# EAGLE design io_board (EAGLE 7.7.0)
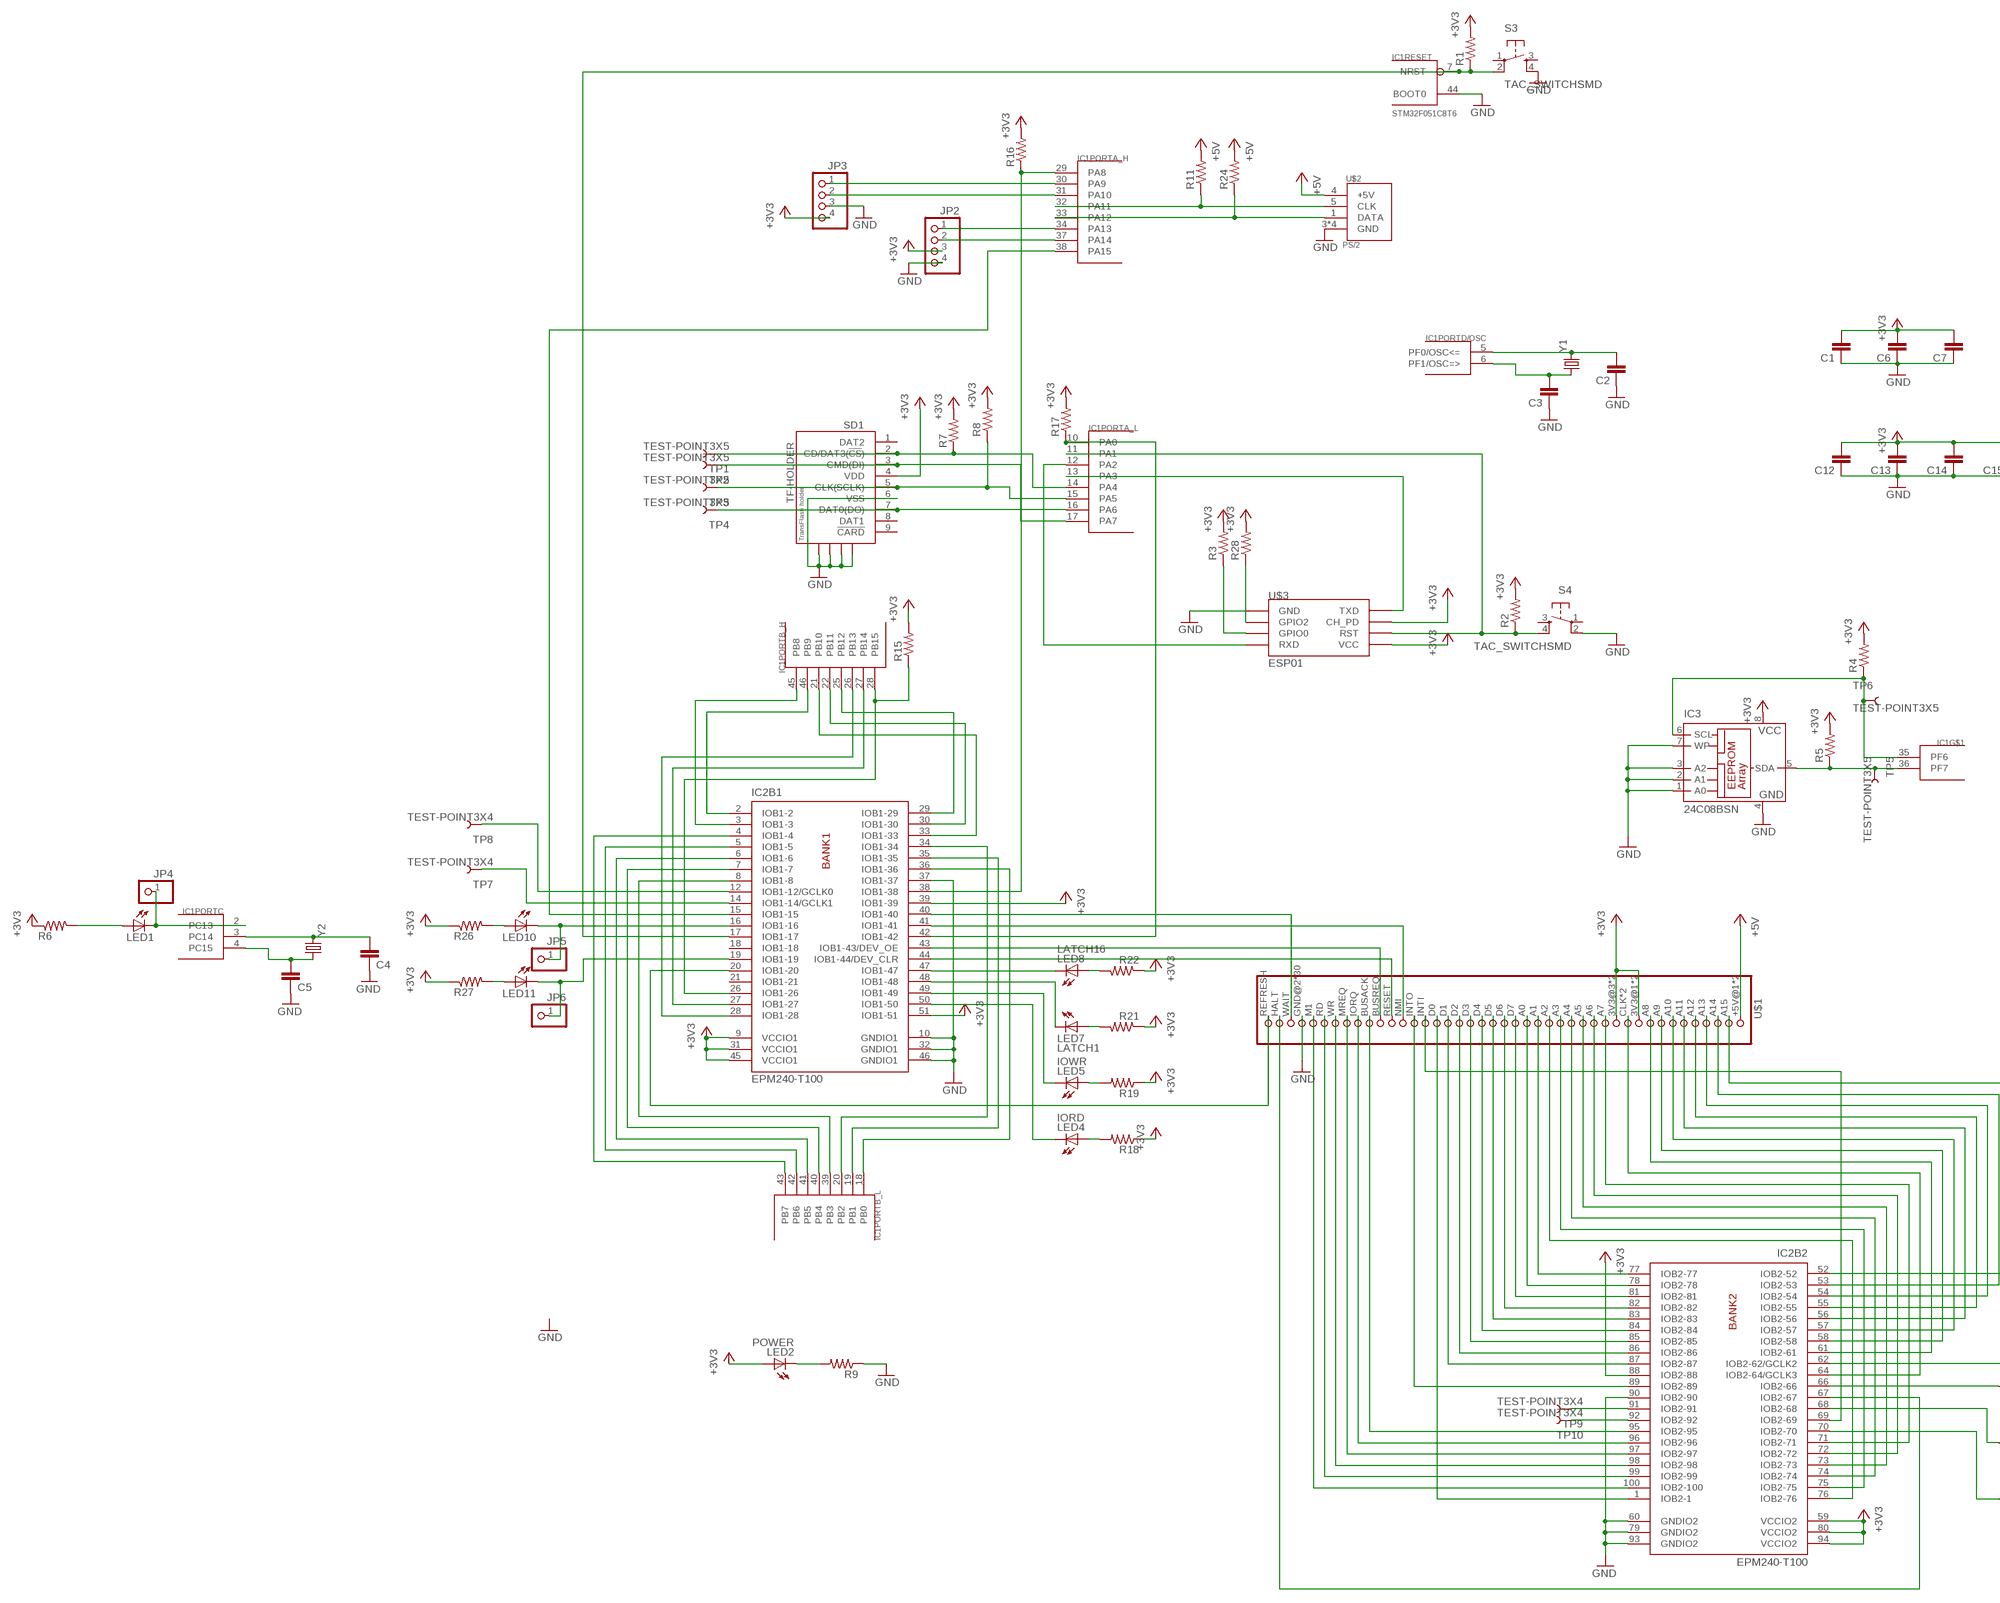
[diagram p0: schematic, sheet 1, part 1 of 2]
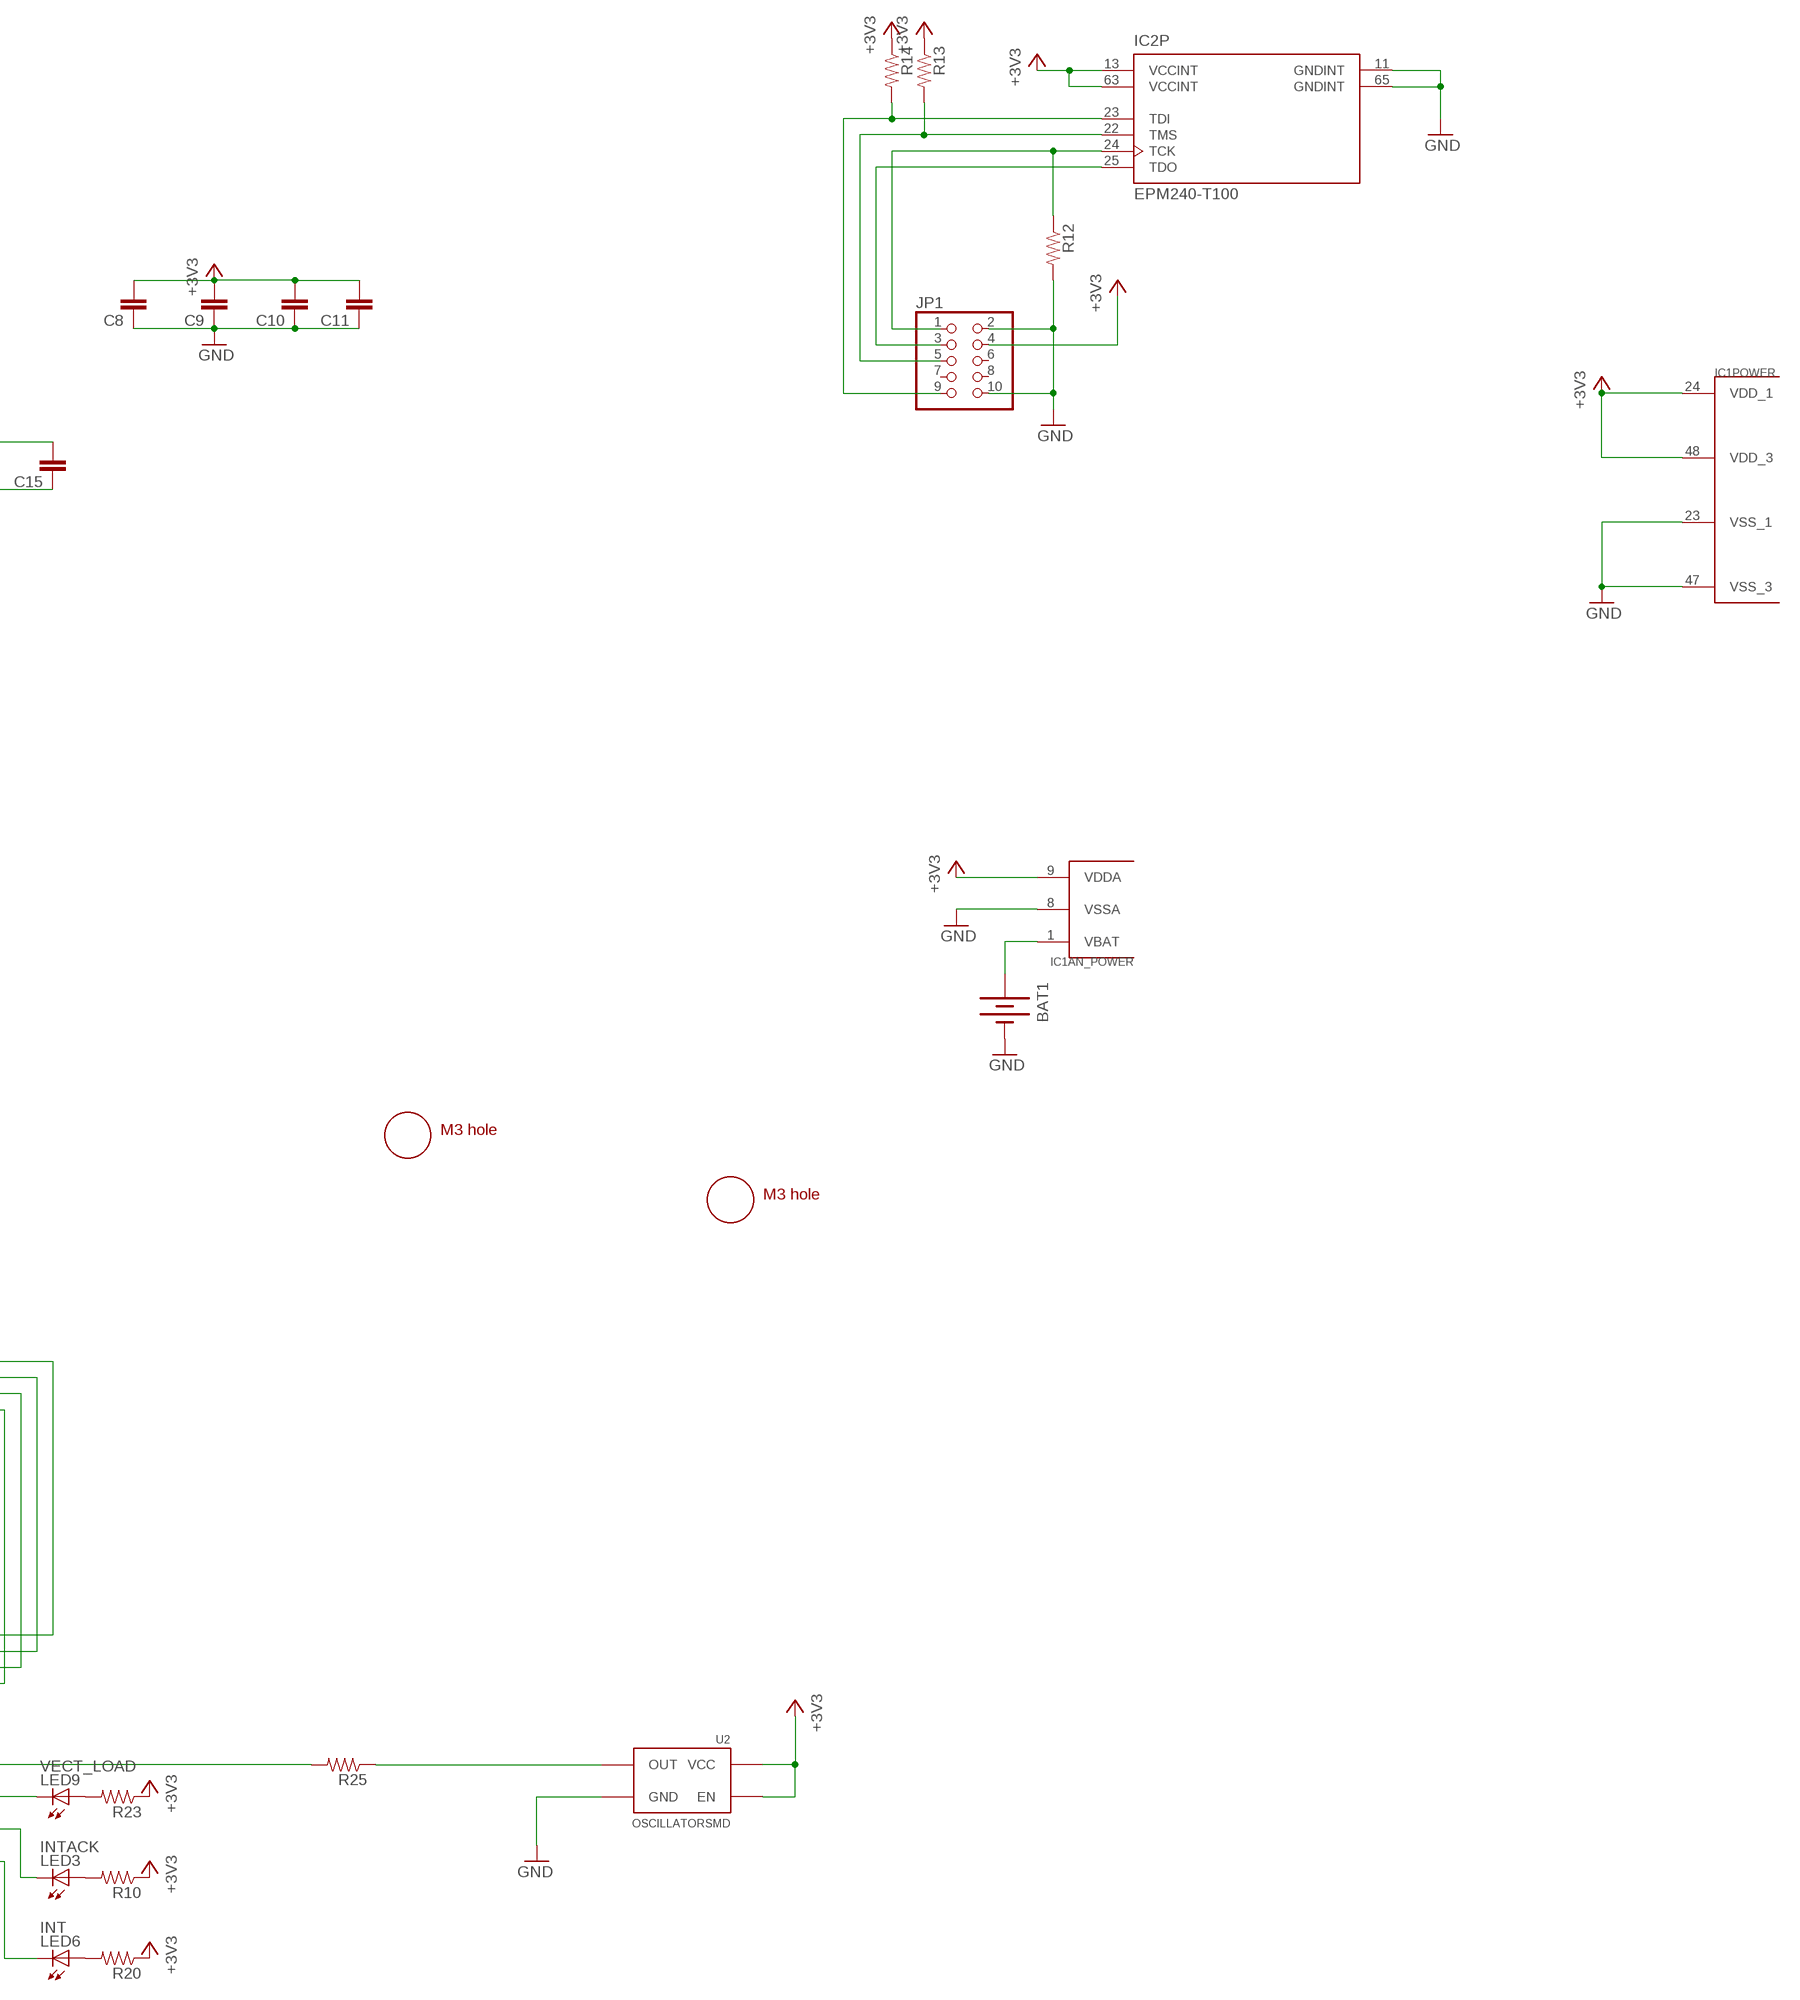
[diagram p1: schematic, sheet 1, part 2 of 2]

## Parts
BAT1  BATTERY20PTH  [BATTCOM_20MM_PTH]
C1  CAP0805  [0805]
C2  CAP0805  [0805]
C3  CAP0805  [0805]
C4  CAP0805  [0805]
C5  CAP0805  [0805]
C6  CAP0805  [0805]
C7  CAP0805  [0805]
C8  CAP0805  [0805]
C9  CAP0805  [0805]
C10  CAP0805  [0805]
C11  CAP0805  [0805]
C12  CAP0805  [0805]
C13  CAP0805  [0805]
C14  CAP0805  [0805]
C15  CAP0805  [0805]
IC1  STM32F051C8T6  [TQFP48]
IC2  EPM240-T100  [TQFP100]
IC3  24C08BSN  [SO-08]
JP1  PINHD-2X5  [2X05]
JP2  PINHD-1X4/90  [1X04/90]
JP3  PINHD-1X4/90  [1X04/90]
JP4  PINHD-1X1  [1X01]
JP5  PINHD-1X1  [1X01]
JP6  PINHD-1X1  [1X01]
LED1  LEDCHIP-LED0805  [CHIP-LED0805]
LED2  POWER  LEDCHIPLED_0805  [CHIPLED_0805]
LED3  INTACK  LEDCHIP-LED0805  [CHIP-LED0805]
LED4  IORD  LEDCHIP-LED0805  [CHIP-LED0805]
LED5  IOWR  LEDCHIP-LED0805  [CHIP-LED0805]
LED6  INT  LEDCHIP-LED0805  [CHIP-LED0805]
LED7  LATCH1  LEDCHIP-LED0805  [CHIP-LED0805]
LED8  LATCH16  LEDCHIP-LED0805  [CHIP-LED0805]
LED9  VECT_LOAD  LEDCHIP-LED0805  [CHIP-LED0805]
LED10  LEDCHIP-LED0805  [CHIP-LED0805]
LED11  LEDCHIP-LED0805  [CHIP-LED0805]
R1  RESISTOR0805-RES  [0805]
R2  RESISTOR0805-RES  [0805]
R3  RESISTOR0805-RES  [0805]
R4  RESISTOR0805-RES  [0805]
R5  RESISTOR0805-RES  [0805]
R6  RESISTOR0805-RES  [0805]
R7  RESISTOR0805-RES  [0805]
R8  RESISTOR0805-RES  [0805]
R9  RESISTOR0805-RES  [0805]
R10  RESISTOR0805-RES  [0805]
R11  RESISTOR0805-RES  [0805]
R12  RESISTOR0805-RES  [0805]
R13  RESISTOR0805-RES  [0805]
R14  RESISTOR0805-RES  [0805]
R15  RESISTOR0805-RES  [0805]
R16  RESISTOR0805-RES  [0805]
R17  RESISTOR0805-RES  [0805]
R18  RESISTOR0805-RES  [0805]
R19  RESISTOR0805-RES  [0805]
R20  RESISTOR0805-RES  [0805]
R21  RESISTOR0805-RES  [0805]
R22  RESISTOR0805-RES  [0805]
R23  RESISTOR0805-RES  [0805]
R24  RESISTOR0805-RES  [0805]
R25  RESISTOR0805-RES  [0805]
R26  RESISTOR0805-RES  [0805]
R27  RESISTOR0805-RES  [0805]
R28  RESISTOR0805-RES  [0805]
S3  TAC_SWITCHSMD  [TACTILE-SWITCH-SMD]
S4  TAC_SWITCHSMD  [TACTILE-SWITCH-SMD]
SD1  TF-HOLDER  [TF-PULL]
TP1  TEST-POINT3X5  [PAD.03X.05]
TP2  TEST-POINT3X5  [PAD.03X.05]
TP3  TEST-POINT3X5  [PAD.03X.05]
TP4  TEST-POINT3X5  [PAD.03X.05]
TP5  TEST-POINT3X5  [PAD.03X.05]
TP6  TEST-POINT3X5  [PAD.03X.05]
TP7  TEST-POINT3X4  [PAD.03X.04]
TP8  TEST-POINT3X4  [PAD.03X.04]
TP9  TEST-POINT3X4  [PAD.03X.04]
TP10  TEST-POINT3X4  [PAD.03X.04]
U2  OSCILLATORSMD  [CRYSTAL-SMD-7X5]
U$1  FAP_BUS  [2X38]
U$2  PS/2  [PS/2]
U$3  ESP01  [ESP01]
U$4  M3_MOUNTING_HOLE  [M3_MOUNTING_HOLE_PACK]
U$5  M3_MOUNTING_HOLE  [M3_MOUNTING_HOLE_PACK]
Y1  CRYSTALHC49US  [HC49US]
Y2  CRYSTALTC26H_EZ  [TC26HEZ]

## Nets
+3V3: C1.2 C6.2 C7.2 C8.2 C9.2 C10.2 C11.2 C12.2 C13.2 C14.2 C15.2 IC1.9(AN_POWER:VDDA) IC1.24(POWER:VDD_1) IC1.48(POWER:VDD_3) IC2.9(B1:VCCIO1) IC2.13(P:VCCINT) IC2.31(B1:VCCIO1) IC2.39(B1:IOB1-39) IC2.45(B1:VCCIO1) IC2.51(B1:IOB1-51) IC2.59(B2:VCCIO2) IC2.63(P:VCCINT) IC2.80(B2:VCCIO2) IC2.88(B2:IOB2-88) IC2.94(B2:VCCIO2) IC3.8(VCC) JP1.4 JP2.3 JP3.4 LED2.A R1.2 R2.2 R3.2 R4.2 R5.2 R6.1 R7.2 R8.2 R10.1 R13.1 R14.1 R15.2 R16.2 R17.2 R18.1 R19.1 R20.1 R21.1 R22.1 R23.1 R26.1 R27.1 R28.2 SD1.4(VDD) U2.P$1(EN) U2.P$4(VCC) U$1.3V3@1 U$1.3V3@2 U$1.3V3@3 U$1.3V3@4 U$3.CH_PD U$3.VCC
+5V: R11.2 R24.2 U$1.+5V@1 U$1.+5V@2 U$2.4(+5V)
GND: BAT1.2(-) C1.1 C2.1 C3.1 C4.1 C5.1 C6.1 C7.1 C8.1 C9.1 C10.1 C11.1 C12.1 C13.1 C14.1 C15.1 IC1.8(AN_POWER:VSSA) IC1.23(POWER:VSS_1) IC1.44(RESET:BOOT0) IC1.47(POWER:VSS_3) IC2.10(B1:GNDIO1) IC2.11(P:GNDINT) IC2.32(B1:GNDIO1) IC2.37(B1:IOB1-37) IC2.46(B1:GNDIO1) IC2.60(B2:GNDIO2) IC2.65(P:GNDINT) IC2.79(B2:GNDIO2) IC2.90(B2:IOB2-90) IC2.93(B2:GNDIO2) IC3.1(A0) IC3.2(A1) IC3.3(A2) IC3.4(GND) IC3.7(WP) JP1.2 JP1.10 JP2.4 JP3.3 R9.1 R12.2 S3.4 S4.2 SD1.6(VSS) SD1.S1 SD1.S2 SD1.S3 SD1.S4 U2.P$2(GND) U$1.GND@2(GND) U$1.GND@3(GND) U$1.GND@4(GND) U$1.GND@5(GND) U$1.GND@6(GND) U$1.GND@7(GND) U$1.GND@8(GND) U$1.GND@9(GND) U$1.GND@13(GND) U$1.GND@14(GND) U$1.GND@15(GND) U$1.GND@16(GND) U$1.GND@17(GND) U$1.GND@18(GND) U$1.GND@19(GND) U$1.GND@20(GND) U$1.GND@21(GND) U$1.GND@22(GND) U$1.GND@23(GND) U$1.GND@24(GND) U$1.GND@25(GND) U$1.GND@26(GND) U$1.GND@27(GND) U$1.GND@28(GND) U$1.GND@30(GND) U$1.GND@34(GND) U$1.GND@35(GND) U$1.GND@36(GND) U$1.GND@37(GND) U$1.GND@38(GND) U$2.3(GND) U$2.P$1(GND) U$2.P$2(GND) U$2.P$3(GND) U$3.GND
N$1: IC2.67(B2:IOB2-67) U$1.HALT
N$2: R25.1 U2.P$3(OUT)
N$3: IC2.20(B1:IOB1-20) U$1.REFRESH
N$4: IC2.12(B1:IOB1-12/GCLK0) TP8.P$1
N$5: IC1.7(RESET:NRST) IC2.17(B1:IOB1-17) R1.1 S3.2
N$6: C2.2 IC1.5(PORTD/OSC:PF0/OSC<=) Y1.2
N$7: C3.2 IC1.6(PORTD/OSC:PF1/OSC=>) Y1.1
N$8: C4.2 IC1.3(PORTC:PC14) Y2.2
N$9: C5.2 IC1.4(PORTC:PC15) Y2.1
N$10: BAT1.1(+) IC1.1(AN_POWER:VBAT)
N$11: IC1.37(PORTA_H:PA14) JP2.2
N$12: IC1.34(PORTA_H:PA13) JP2.1
N$13: IC2.62(B2:IOB2-62/GCLK2) R25.2
N$14: IC2.43(B1:IOB1-43/DEV_OE) U$1.BUSREQ
N$15: IC2.100(B2:IOB2-100) U$1.M1
N$16: IC2.99(B2:IOB2-99) U$1.RD
N$17: IC2.98(B2:IOB2-98) U$1.WR
N$18: IC2.97(B2:IOB2-97) U$1.MREQ
N$19: IC2.96(B2:IOB2-96) U$1.IORQ
N$20: IC2.95(B2:IOB2-95) U$1.BUSACK
N$21: IC2.44(B1:IOB1-44/DEV_CLR) U$1.RESET
N$22: LED3.A R10.2
N$23: IC2.89(B2:IOB2-89) U$1.INTO
N$24: IC2.1(B2:IOB2-1) U$1.D0
N$25: IC2.87(B2:IOB2-87) U$1.D1
N$26: IC2.86(B2:IOB2-86) U$1.D2
N$27: IC2.85(B2:IOB2-85) U$1.D3
N$28: IC2.84(B2:IOB2-84) U$1.D4
N$29: IC2.83(B2:IOB2-83) U$1.D5
N$30: IC2.82(B2:IOB2-82) U$1.D6
N$31: IC2.81(B2:IOB2-81) U$1.D7
N$32: IC2.78(B2:IOB2-78) U$1.A0
N$33: IC2.77(B2:IOB2-77) U$1.A1
N$34: IC2.76(B2:IOB2-76) U$1.A2
N$35: IC2.75(B2:IOB2-75) U$1.A3
N$36: IC2.74(B2:IOB2-74) U$1.A4
N$37: IC2.73(B2:IOB2-73) U$1.A5
N$38: IC2.72(B2:IOB2-72) U$1.A6
N$39: IC2.71(B2:IOB2-71) U$1.A7
N$40: IC2.64(B2:IOB2-64/GCLK3) U$1.CLK U$1.CLK@2
N$41: IC2.61(B2:IOB2-61) U$1.A8
N$42: IC2.58(B2:IOB2-58) U$1.A9
N$43: IC2.57(B2:IOB2-57) U$1.A10
N$44: IC2.56(B2:IOB2-56) U$1.A11
N$45: IC2.55(B2:IOB2-55) U$1.A12
N$46: IC2.54(B2:IOB2-54) U$1.A13
N$47: IC2.53(B2:IOB2-53) U$1.A14
N$48: IC2.52(B2:IOB2-52) U$1.A15
N$49: IC1.46(PORTB_H:PB9) IC2.2(B1:IOB1-2)
N$50: IC1.45(PORTB_H:PB8) IC2.3(B1:IOB1-3)
N$51: IC1.43(PORTB_L:PB7) IC2.4(B1:IOB1-4)
N$52: IC1.42(PORTB_L:PB6) IC2.5(B1:IOB1-5)
N$53: IC1.41(PORTB_L:PB5) IC2.6(B1:IOB1-6)
N$54: IC1.40(PORTB_L:PB4) IC2.7(B1:IOB1-7)
N$55: IC1.39(PORTB_L:PB3) IC2.8(B1:IOB1-8)
N$56: IC1.28(PORTB_H:PB15) IC2.26(B1:IOB1-26) R15.1
N$57: IC1.27(PORTB_H:PB14) IC2.27(B1:IOB1-27)
N$58: IC1.26(PORTB_H:PB13) IC2.28(B1:IOB1-28)
N$59: IC1.25(PORTB_H:PB12) IC2.29(B1:IOB1-29)
N$60: IC1.22(PORTB_H:PB11) IC2.30(B1:IOB1-30)
N$61: IC1.21(PORTB_H:PB10) IC2.33(B1:IOB1-33)
N$62: IC1.20(PORTB_L:PB2) IC2.34(B1:IOB1-34)
N$63: IC1.19(PORTB_L:PB1) IC2.35(B1:IOB1-35)
N$64: IC1.18(PORTB_L:PB0) IC2.36(B1:IOB1-36)
N$65: IC1.32(PORTA_H:PA11) R11.1 U$2.5(CLK)
N$66: IC1.33(PORTA_H:PA12) R24.1 U$2.1(DATA)
N$67: IC1.11(PORTA_L:PA1) R2.1 S4.4 U$3.RST
N$68: R3.1 U$3.GPIO0
N$69: IC1.36(PF7) IC3.5(SDA) R5.1 TP5.P$1
N$70: IC1.35(PF6) IC3.6(SCL) R4.1 TP6.P$1
N$71: IC1.31(PORTA_H:PA10) JP3.2
N$72: IC1.30(PORTA_H:PA9) JP3.1
N$73: IC1.2(PORTC:PC13) JP4.1 LED1.C
N$74: LED1.A R6.2
N$75: IC1.12(PORTA_L:PA2) U$3.RX(RXD)
N$76: IC1.13(PORTA_L:PA3) U$3.TX(TXD)
N$77: LED4.A R18.2
N$78: IC1.14(PORTA_L:PA4) R7.1 SD1.2(CD/DAT3(!CS!)) TP1.P$1
N$79: IC1.17(PORTA_L:PA7) SD1.3(CMD(DI)) TP2.P$1
N$80: IC1.16(PORTA_L:PA6) SD1.7(DAT0(DO)) TP4.P$1
N$81: IC1.15(PORTA_L:PA5) R8.1 SD1.5(CLK(SCLK)) TP3.P$1
N$82: LED2.C R9.2
N$83: LED7.A R21.2
N$84: LED5.A R19.2
N$85: IC1.38(PORTA_H:PA15) IC2.15(B1:IOB1-15)
N$86: IC1.10(PORTA_L:PA0) IC2.42(B1:IOB1-42) R17.1
N$87: IC1.29(PORTA_H:PA8) IC2.38(B1:IOB1-38) R16.1
N$88: LED6.A R20.2
N$89: LED8.A R22.2
N$90: IC2.47(B1:IOB1-47) LED8.C
N$91: IC2.48(B1:IOB1-48) LED7.C
N$92: IC2.49(B1:IOB1-49) LED5.C
N$93: IC2.50(B1:IOB1-50) LED4.C
N$94: LED9.A R23.2
N$95: IC2.66(B2:IOB2-66) LED9.C
N$96: IC2.68(B2:IOB2-68) LED3.C
N$97: IC2.70(B2:IOB2-70) LED6.C
N$98: IC2.14(B1:IOB1-14/GCLK1) TP7.P$1
N$99: IC2.69(B2:IOB2-69) U$1.INTI
N$100: IC2.41(B1:IOB1-41) U$1.NMI
N$101: IC2.40(B1:IOB1-40) U$1.WAIT
N$102: LED10.A R26.2
N$103: IC2.16(B1:IOB1-16) JP5.1 LED10.C
N$104: LED11.A R27.2
N$105: IC2.19(B1:IOB1-19) JP6.1 LED11.C
N$106: IC2.91(B2:IOB2-91) TP9.P$1
N$107: IC2.92(B2:IOB2-92) TP10.P$1
N$108: R28.1 U$3.GPIO2
TCK: IC2.24(P:TCK) JP1.1 R12.1
TDI: IC2.23(P:TDI) JP1.9 R14.2
TDO: IC2.25(P:TDO) JP1.3
TMS: IC2.22(P:TMS) JP1.5 R13.2
Unconnected: IC2.18(B1:IOB1-18) IC2.21(B1:IOB1-21) JP1.6 JP1.7 JP1.8 S3.1 S3.3 S4.1 S4.3 SD1.1(DAT2) SD1.8(DAT1) SD1.9(!CARD)

## Library data of the parts
BAT1 = SparkFun-Electromechanical:BATTERY: Battery Holders Various common sizes : AA, AAA, 18650 (PRT-12895), 20mm coin cell and 12mm coin cell. 20MM_4LEGS, BATT-10373
C1-C15 = SparkFun-Passives:CAP: Capacitor Standard 0603 ceramic capacitor, and 0.1" leaded capacitor.
IC1 = stm32f051:STM32F051C8T6: ST STM32F101/103 48pin LQFP
IC2 = altera-max2:EPM240-T100: Altera MAX II CPLD - EPM240 TQFP-100 Device EPM240 from Altera MAX II Family Feature EPM240 LEs 240 Typical Equivalent Macrocells 192 Equivalent Macrocell Range 128 ... 240 UFM Size (bits) 8192 User I/O pins 80 tPD1 (ns) 4.7 fCNT (MHz) 304 tSU (ns) 1.7 tCO (ns) 4.3
IC3 = microchip:24*: Serial EEPROM I2C; MPN: AT24C08BN-SH-B; OC_FARNELL: 1362645; OC_NEWARK: 50M3318
JP1 = pinhead:PINHD-2X5: PIN HEADER
JP2 JP3 = pinhead:PINHD-1X4: PIN HEADER
JP4-JP6 = pinhead:PINHD-1X1: PIN HEADER
LED1-LED11 = adafruit:LED: LED OSRAM: - CHIPLED LG R971, LG N971, LY N971, LG Q971, LY Q971, LO R971, LY R971 LH N974, LH R974 LS Q976, LO Q976, LY Q976 LO Q996 - Hyper CHIPLED LW Q18S LB Q993, LB Q99A, LB R99A - SideLED LS A670, LO A670, LY A670, LG A670, LP A670 LB A673, LV A673, LT A673, LW A673 LH A674 LY A675 LS A676, LA A676, LO A676, LY A676, LW A676 LS A679, LY A679, LG A679 - Hyper Micro SIDELED® LS Y876, LA Y876, LO Y876, LY Y876 LT Y87S - SmartLED LW L88C, LW L88S LB L89C, LB L89S, LG L890 LS L89K, LO L89K, LY L89K LS L896, LA L896, LO L896, LY L896 - TOPLED LS T670, LO T670, LY T670, LG T670, LP T670 LSG T670, LSP T670, LSY T670, LOP T670, LYG T670 LG T671, LOG T671, LSG T671 LB T673, LV T673, LT T673, LW T673 LH T674 LS T676, LA T676, LO T676, LY T676, LB T676, LH T676, LSB T676, LW T676 LB T67C, LV T67C, LT T67C, LS T67K, LO T67K, LY T67K, LW E67C LS E67B, LA E67B, LO E67B, LY E67B, LB E67C, LV E67C, LT E67C LW T67C LS T679, LY T679, LG T679 LS T770, LO T770, LY T770, LG T770, LP T770 LB T773, LV T773, LT T773, LW T773 LH T774 LS E675, LA E675, LY E675, LS T675 LS T776, LA T776, LO T776, LY T776, LB T776 LHGB T686 LT T68C, LB T68C - Hyper Mini TOPLED® LB M676 - Mini TOPLED Santana® LG M470 LS M47K, LO M47K, LY M47K Source: http://www.osram.convergy.de/
R1-R28 = SparkFun-Passives:RESISTOR: Resistor Basic schematic elements and footprints for 0603, 1206, and PTH resistors.
S3 S4 = Adafruit Feather M0 Adalogger:TAC_SWITCH: Momentary Switch Button commonly used for reset or general input. Spark Fun Electronics SKU : COM-00097 SMT- SWCH-08247; PROD_ID: SWCH-08247
SD1 = Adafruit Feather M0 Adalogger:TF-HOLDER: TF / Micro SD socket is PUSH-PUSH type, the card can be pushed into and auto locked and pushed out by simply press the card. Surface Mounting type.
TP1-TP10 = SparkFun-Passives:TEST-POINT: Bare copper test points for troubleshooting or ICT
U2 = SparkFun-FreqCtrl:OSCILLATOR: Generic 5x3 and 7x5 oscillators
U$1 = fap_bus:FAP_BUS
U$2 = ps2:PS/2: PS/2 connector
U$3 = esp8266modules:ESP01: ESP8266 Wifi module 01
U$4 U$5 = m3_mounting_hole:M3_MOUNTING_HOLE
Y1 Y2 = SparkFun-FreqCtrl:CRYSTAL: Various standard crystals. Proven footprints.

## Board
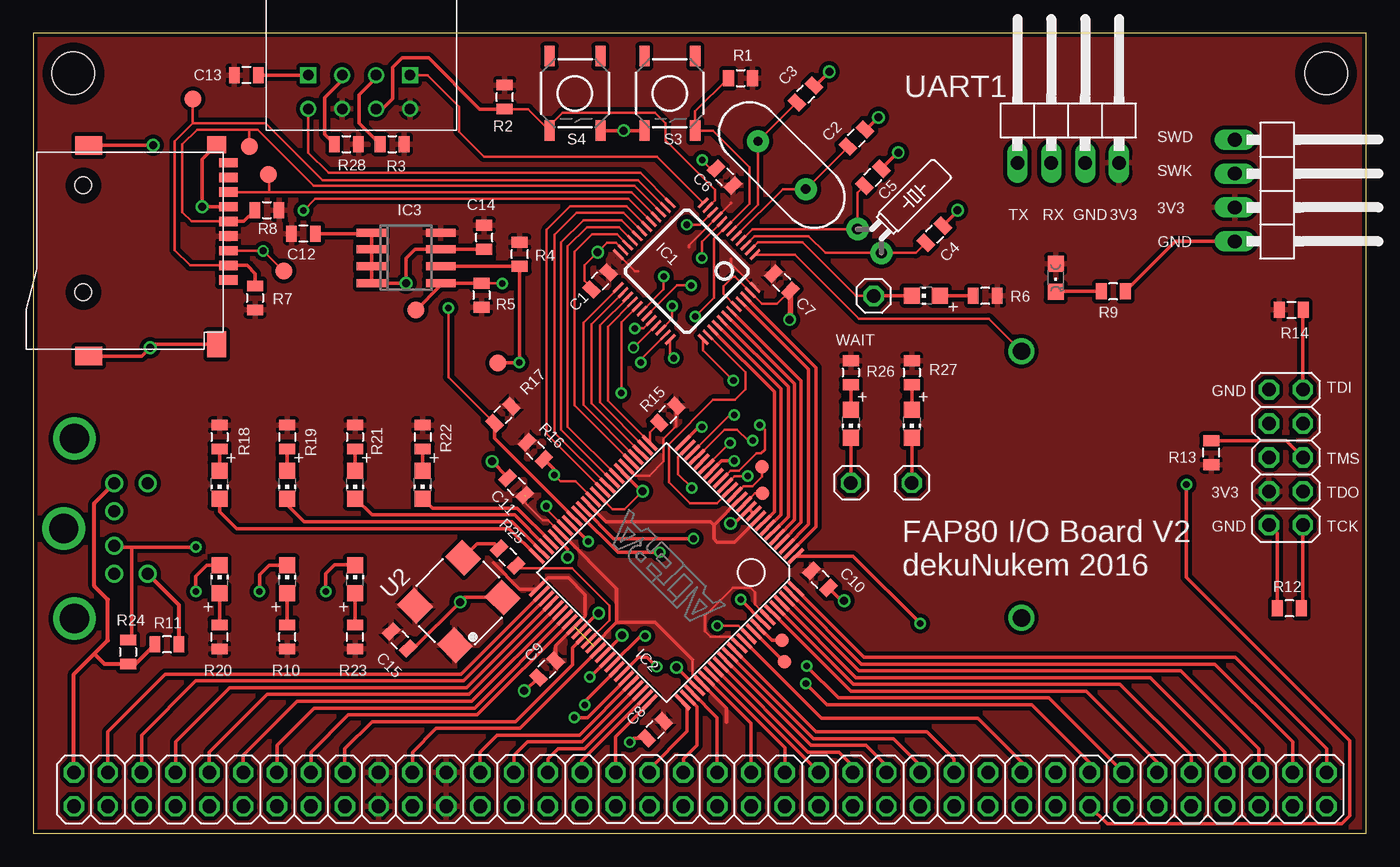
[diagram p2: board, top side]
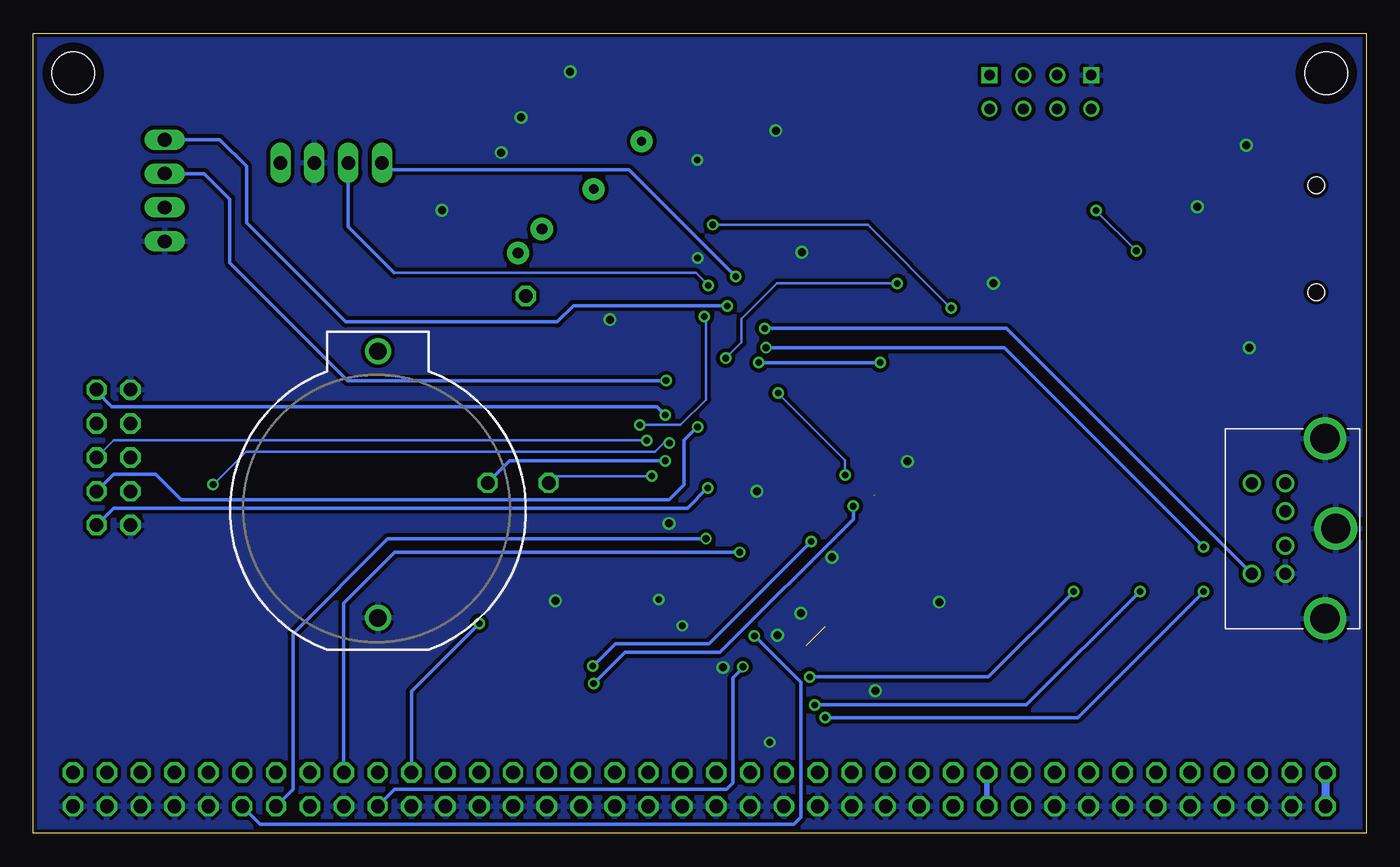
[diagram p3: board, bottom side, seen from below]

Size 100 x 60 mm. Coordinates in mm from the lower left corner, seen from the top.
Outline: 0,0 100,0 100,60 0,60 0,0
Copper layers (1*16): Top 0.035mm / dielectric 1.5mm / Bottom 0.035mm
Design rules "SparkFun-2-layer-TIGHT": minimum track width 7mil, minimum drill 15mil, track to track 7mil, track to pad 7mil, pad to pad 7mil, via to via 7mil, smd to smd 7mil, copper to edge 7mil, drill to drill 7mil, minimum pad ring 7mil, minimum via ring 7mil, stop-mask expansion 4mil, vias tented up to drill 25mil, thermal gap 10mil
tRestrict: area 2.7,47.6 to 4.8,49.6; area 2.7,39.6 to 4.8,41.6

### Footprints (pad centres in the part's own frame; a part is rotated, then mirrored left to right if it is on the bottom)
BATTCOM_20MM_PTH = drill 1.3: 1 11.85,0; 2 -8.15,0
0805 = smd 0.8 x 1.2: 1 -0.9,0; 2 0.9,0
TQFP48 = smd 0.2 x 1: 1 -2.75,-4.5; 2 -2.25,-4.5; 3 -1.75,-4.5; 4 -1.25,-4.5; 5 -0.75,-4.5; 6 -0.25,-4.5; 7 0.25,-4.5; 8 0.75,-4.5; 9 1.25,-4.5; 10 1.75,-4.5; 11 2.25,-4.5; 12 2.75,-4.5; 25 2.75,4.5; 26 2.25,4.5; 27 1.75,4.5; 28 1.25,4.5; 29 0.75,4.5; 30 0.25,4.5; 31 -0.25,4.5; 32 -0.75,4.5; 33 -1.25,4.5; 34 -1.75,4.5; 35 -2.25,4.5; 36 -2.75,4.5 | smd 1 x 0.2: 13 4.5,-2.75; 14 4.5,-2.25; 15 4.5,-1.75; 16 4.5,-1.25; 17 4.5,-0.75; 18 4.5,-0.25; 19 4.5,0.25; 20 4.5,0.75; 21 4.5,1.25; 22 4.5,1.75; 23 4.5,2.25; 24 4.5,2.75; 37 -4.5,2.75; 38 -4.5,2.25; 39 -4.5,1.75; 40 -4.5,1.25; 41 -4.5,0.75; 42 -4.5,0.25; 43 -4.5,-0.25; 44 -4.5,-0.75; 45 -4.5,-1.25; 46 -4.5,-1.75; 47 -4.5,-2.25; 48 -4.5,-2.75
TQFP100 = smd 0.27 x 1.5: 1 -6,-7.75; 2 -5.5,-7.75; 3 -5,-7.75; 4 -4.5,-7.75; 5 -4,-7.75; 6 -3.5,-7.75; 7 -3,-7.75; 8 -2.5,-7.75; 9 -2,-7.75; 10 -1.5,-7.75; 11 -1,-7.75; 12 -0.5,-7.75; 13 0,-7.75; 14 0.5,-7.75; 15 1,-7.75; 16 1.5,-7.75; 17 2,-7.75; 18 2.5,-7.75; 19 3,-7.75; 20 3.5,-7.75; 21 4,-7.75; 22 4.5,-7.75; 23 5,-7.75; 24 5.5,-7.75; 25 6,-7.75; 51 6,7.75; 52 5.5,7.75; 53 5,7.75; 54 4.5,7.75; 55 4,7.75; 56 3.5,7.75; 57 3,7.75; 58 2.5,7.75; 59 2,7.75; 60 1.5,7.75; 61 1,7.75; 62 0.5,7.75; 63 0,7.75; 64 -0.5,7.75; 65 -1,7.75; 66 -1.5,7.75; 67 -2,7.75; 68 -2.5,7.75; 69 -3,7.75; 70 -3.5,7.75; 71 -4,7.75; 72 -4.5,7.75; 73 -5,7.75; 74 -5.5,7.75; 75 -6,7.75 | smd 1.5 x 0.27: 26 7.75,-6; 27 7.75,-5.5; 28 7.75,-5; 29 7.75,-4.5; 30 7.75,-4; 31 7.75,-3.5; 32 7.75,-3; 33 7.75,-2.5; 34 7.75,-2; 35 7.75,-1.5; 36 7.75,-1; 37 7.75,-0.5; 38 7.75,0; 39 7.75,0.5; 40 7.75,1; 41 7.75,1.5; 42 7.75,2; 43 7.75,2.5; 44 7.75,3; 45 7.75,3.5; 46 7.75,4; 47 7.75,4.5; 48 7.75,5; 49 7.75,5.5; 50 7.75,6; 76 -7.75,6; 77 -7.75,5.5; 78 -7.75,5; 79 -7.75,4.5; 80 -7.75,4; 81 -7.75,3.5; 82 -7.75,3; 83 -7.75,2.5; 84 -7.75,2; 85 -7.75,1.5; 86 -7.75,1; 87 -7.75,0.5; 88 -7.75,0; 89 -7.75,-0.5; 90 -7.75,-1; 91 -7.75,-1.5; 92 -7.75,-2; 93 -7.75,-2.5; 94 -7.75,-3; 95 -7.75,-3.5; 96 -7.75,-4; 97 -7.75,-4.5; 98 -7.75,-5; 99 -7.75,-5.5; 100 -7.75,-6
SO-08 = smd 0.6 x 2.2: 1 -1.905,-2.6; 2 -0.635,-2.6; 3 0.635,-2.6; 4 1.905,-2.6; 5 1.905,2.6; 6 0.635,2.6; 7 -0.635,2.6; 8 -1.905,2.6
2X05 = drill 1.016 octagon: 1 -5.08,-1.27; 2 -5.08,1.27; 3 -2.54,-1.27; 4 -2.54,1.27; 5 0,-1.27; 6 0,1.27; 7 2.54,-1.27; 8 2.54,1.27; 9 5.08,-1.27; 10 5.08,1.27
1X04/90 = drill 1.016 long: 1 -3.81,-3.81; 2 -1.27,-3.81; 3 1.27,-3.81; 4 3.81,-3.81
1X01 = drill 1.016 octagon: 1 0,0
CHIP-LED0805 = smd 1.2 x 1.2: A 0,-1.05; C 0,1.05
CHIPLED_0805 = smd 1.2 x 1.2: A 0,-1.05; C 0,1.05
TACTILE-SWITCH-SMD = smd 1.524 x 0.762: 1 -2.794,1.905; 2 2.794,1.905; 3 -2.794,-1.905; 4 2.794,-1.905
TF-PULL = smd 0.7 x 1.4: 1 -2.2,-7.62; 2 -1.1,-7.62; 3 0,-7.62; 4 1.1,-7.62; 5 2.2,-7.62; 6 3.3,-7.62; 7 4.4,-7.62; 8 5.5,-7.62; 9 6.6,-7.62 | smd 1.4 x 2: S1 -7.9,2.85; S2 7.9,2.85 | smd 1.28 x 1.4: S3 7.96,-6.75 | smd 1.95 x 1.4: S4 -7.025,-6.75 | hole 1.25: -3.1,3.25; 4.9,3.25
PAD.03X.05 = smd 1.27 x 1.27: P$1 0,0
PAD.03X.04 = smd 1.016 x 1.016: P$1 0,0
CRYSTAL-SMD-7X5 = smd 1.8 x 2: P$1 0,0; P$2 5.08,0; P$3 5.08,4.2; P$4 0,4.2
2X38 = drill 1.016 octagon: 3V3@1 -6.35,0; 3V3@2 -6.35,2.54; 3V3@3 -1.27,0; 3V3@4 -1.27,2.54; +5V@1 -29.21,2.54; +5V@2 -29.21,0; A0 19.05,2.54; A1 16.51,2.54; A2 13.97,2.54; A3 11.43,2.54; A4 8.89,2.54; A5 6.35,2.54; A6 3.81,2.54; A7 1.27,2.54; A8 -8.89,2.54; A9 -11.43,2.54; A10 -13.97,2.54; A11 -16.51,2.54; A12 -19.05,2.54; A13 -21.59,2.54; A14 -24.13,2.54; A15 -26.67,2.54; BUSACK 52.07,2.54; BUSREQ 49.53,2.54; CLK -3.81,2.54; CLK@2 -3.81,0; D0 39.37,2.54; D1 36.83,2.54; D2 34.29,2.54; D3 31.75,2.54; D4 29.21,2.54; D5 26.67,2.54; D6 24.13,2.54; D7 21.59,2.54; GND@2 -26.67,0; GND@3 -24.13,0; GND@4 -21.59,0; GND@5 -19.05,0; GND@6 -16.51,0; GND@7 -13.97,0; GND@8 -11.43,0; GND@9 -8.89,0; GND@13 1.27,0; GND@14 3.81,0; GND@15 6.35,0; GND@16 8.89,0; GND@17 11.43,0; GND@18 13.97,0; GND@19 16.51,0; GND@20 19.05,0; GND@21 21.59,0; GND@22 24.13,0; GND@23 26.67,0; GND@24 29.21,0; GND@25 31.75,0; GND@26 34.29,0; GND@27 36.83,0; GND@28 39.37,0; GND@30 44.45,0; GND@34 54.61,0; GND@35 57.15,0; GND@36 59.69,0; GND@37 62.23,0; GND@38 64.77,0; HALT 52.07,0; INTI 41.91,0; INTO 41.91,2.54; IORQ 54.61,2.54; M1 64.77,2.54; MREQ 57.15,2.54; NMI 44.45,2.54; RD 62.23,2.54; REFRESH 46.99,0; RESET 46.99,2.54; WAIT 49.53,0; WR 59.69,2.54
PS/2 = drill 0.9: 1 1.3,-3.8; 2 -1.3,-3.8; 3 3.4,-3.8; 4 -3.4,-3.8; 5 3.4,-6.3; 6 -3.4,-6.3 | drill 2.2: P$1 0,0; P$2 -6.75,-0.8; P$3 6.75,-0.8
ESP01 = drill 0.8: CH_PD -1.285,-8.178; GPIO0 1.255,-5.638; GPIO2 -1.285,-5.638; RST 1.255,-8.178; TX -3.825,-8.178; VCC 3.795,-8.178 | drill 0.8 square: GND -3.825,-5.638; RX 3.795,-5.638
M3_MOUNTING_HOLE_PACK = hole 3.2: 0,0
HC49US = drill 0.7 pad 1.651: 1 -2.54,0; 2 2.54,0
TC26HEZ = drill 0.813 pad 1.676: 1 -1.27,0; 2 1.27,0

### Placement (x,y rotation side)
BAT1  74.14,24.31 90 bottom
C1  42.52,41.43 45 top
C2  61.75,52.15 225 top
C3  57.94,55.45 225 top
C4  67.61,44.93 225 top
C5  62.99,49.2 225 top
C6  51.87,49.23 315 top
C7  56.16,41.33 135 top
C8  46.66,7.77 45 top
C9  38.53,12.32 45 top
C10  59.03,19.05 135 top
C11  36.22,26.01 315 top
C12  20.27,44.98 180 top
C13  15.98,56.87 180 top
C14  33.83,44.7 90 top
C15  27.48,14.5 135 top
IC1  49.02,42.16 135 top
IC2  47.5,19.56 135 top
IC3  27.97,43.15 270 top
JP1  93.98,28.19 90 top
JP2  93.95,48.21 270 top
JP3  77.65,54.1 0 top
JP4  63.04,40.31 0 top
JP5  61.34,26.29 0 top
JP6  65.91,26.29 0 top
LED1  66.95,40.34 90 top
LED2  76.71,41.66 180 top
LED3  19.05,19.05 0 top
LED4  13.97,26.16 180 top
LED5  19.05,26.16 180 top
LED6  13.97,19.05 0 top
LED7  24.13,26.16 180 top
LED8  29.21,26.16 180 top
LED9  24.13,19.05 0 top
LED10  61.34,30.73 180 top
LED11  65.91,30.73 180 top
R1  53.06,56.64 0 top
R2  35.36,55.22 90 top
R3  26.92,51.69 0 top
R4  36.5,43.43 90 top
R5  33.63,40.36 270 top
R6  71.42,40.31 180 top
R7  16.64,40.16 270 top
R8  17.53,46.74 0 top
R9  81.03,40.64 180 top
R10  19.05,14.73 90 top
R11  10.03,14.17 180 top
R12  94.23,16.87 180 top
R13  88.37,28.55 90 top
R14  94.39,39.27 0 top
R15  47.6,31.42 45 top
R16  37.67,28.7 135 top
R17  35.23,31.39 45 top
R18  13.97,29.72 270 top
R19  19.05,29.72 270 top
R20  13.97,14.73 90 top
R21  24.13,29.72 270 top
R22  29.21,29.72 270 top
R23  24.13,14.73 90 top
R24  7.11,13.59 270 top
R25  35.59,20.73 315 top
R26  61.34,34.54 270 top
R27  65.91,34.54 270 top
R28  23.5,51.69 0 top
S3  47.75,55.5 270 top
S4  40.64,55.5 270 top
SD1  7.01,43.69 90 top
TP1  11.96,55.09 0 top
TP2  18.8,42.19 0 top
TP3  16.21,51.51 0 top
TP4  17.65,49.4 0 top
TP5  28.7,39.24 0 top
TP6  34.85,35.28 0 top
TP7  54.66,27.51 0 top
TP8  54.71,25.5 0 top
TP9  56.36,12.85 0 top
TP10  56.16,14.48 0 top
U2  31.62,14.1 45 top
U$1  32.26,2.03 0 top
U$2  2.29,22.86 270 bottom
U$3  24.46,62.51 0 top
U$4  3,57 0 top
U$5  97,57 0 top
Y1  56.16,50.11 315 top
Y2  62.74,44.42 315 top

### Tracks (layer width: path | path; a pad name or v marks a point on that pad's centre or on a via)
+3V3  (2 unrouted)
  Top 0.203: IC2.31 45.18,26.82 46.23,26.82 47.3,27.89 47.3,29.59 48.24,30.53 R15.2 | IC2.80 50.1,11.3 49.45,11.95 49.45,13.01 | IC1.24 45.16,42.14 45.36,42.14 | IC1.48 52.35,42.73 52.35,43.1 | 52.35,47.3 52.35,47.26 IC1.9 49.2,44.11 49.2,43.94 | IC2.39 | 52.95,14.08 IC2.88 52.3,14.76 50.8,14.76 50.39,15.16 50.39,16.31 52.5,18.41 53.8,18.41 54.13,18.09 54.13,17.17 IC2.94 | IC2.45 38.64,23.47 38.2,23.47 36.86,24.81 C11.2
  Top 0.254: 51.05,23.11 51.05,22.1 51.31,21.84 52.61,21.84 IC2.9 | 51.05,23.11 IC2.13 | C9.2 39.17,14.06 IC2.59 41.4,16.29 41.4,17.91 40.16,19.15 38.61,19.15 IC2.51 36.49,18.32 34.52,20.3 | IC2.63 43.76,15.82 | 43.76,15.82 46.63,15.82 49.45,13.01 | 39.82,22.29 IC2.45 43.76,18.34 43.76,15.82 | 36.93,25.18 36.93,25.32 | 50.1,11.3 52.02,9.38 52.02,8.33 | IC2.39 42.98,23.37 50.8,23.37 51.05,23.11
  pour Top (isolate 0.305): 0,60 0,0 100.08,0 100.08,60
+5V
  Top 0.305: U$1.+5V@1 3.05,11.94 4.57,13.46 | 4.57,13.46 5.59,14.48 5.59,17.53 4.57,18.54 4.57,24.75 U$2.4 | 4.57,13.46 5.34,12.69 R24.2 7.65,12.69 R11.2
  Bottom 0.406: U$1.+5V@1
  Bottom 0.61: U$1.+5V@2 U$1.+5V@1
GND  (via drill 0.5, 0.6)
  Top 0.203: IC1.44 51.79,40.46 51.79,41.02 52.51,41.74 52.63,41.74 IC1.47 54.67,39.7 55.81,39.7 C7.1 | 68.25,45.52 C4.1 | v50.19,50.49 50.82,49.86 C6.1 | IC1.23 43.71,44.3 43.05,44.3 v42.34,43.59 41.35,42.6 41.35,41.43 41.88,40.9 C1.1 | IC2.37 43.45,24.31 44.37,24.31 v45.72,25.65 | v56.74,38.53 56.8,38.58 | v50.16,43.16 50.16,44.37 IC1.8 | IC2.90 52.9,15.57 v51.31,15.57
  Top 0.254: IC2.60 42.33,16.51 v42.42,16.51 | IC2.11 | IC2.11 IC2.10 | IC2.93 53.09,17.51 v53.09,17.53 | v48.26,12.45 IC2.79 | IC2.32 45.65,25.65 v45.72,25.65 | C3.1 58.85,56.09 58.85,56.26 v59.72,57.12 | 62.15,52.78 C2.1 62.48,52.78 v63.4,53.7 | 63.7,49.84 C5.1 64.85,51.05 v64.9,51.05 | 67.97,45.57 C4.1 69.34,46.66 v69.34,46.74 | S4.2 v44.3,52.7 S3.4 | SD1.6 v12.68,46.99 12.68,50.56 SD1.S3 | v8.99,51.61 8.97,51.59 SD1.S2 | SD1.S4 9,36.66 v8.76,36.42 8.13,35.79 SD1.S1 | 46.02,7.11 C8.1 45.06,7.14 v44.76,6.83 | C10.1 60.63,17.45 v60.83,17.45 | 37.84,11.68 C9.1 36.91,10.69 v36.83,10.69 | C12.1 25.29,44.98 IC3.1 IC3.2 IC3.3 IC3.4 v27.96,41.25 27.96,43.13 28.63,43.79 IC3.7 33.82,43.79 C14.1 | C13.1 U$3.GND | v40.08,20.7 40.08,21.32 IC2.46 | v34.42,27.89 35.58,26.72 C11.1 | U2.P$2 32.37,17.69 v32.03,17.35 28.55,13.87 C15.1 | R9.1 85.69,44.4 JP2.4 | v52.3,23.24 52.59,23.24 IC2.11 | R12.2 93.33,22.49 JP1.2 | IC2.65 44.17,14.82 v44.17,14.86
  Top 0.406: 56.8,38.58 C7.1
  pour Bottom (isolate 0.279): 0,60 0,0 100.08,0 100.08,60
N$1  (via drill 0.5)
  Top 0.254: v45.9,14.81 45.58,14.81 IC2.67
  Bottom 0.254: U$1.HALT 82.98,0.69 42.93,0.69 42.42,1.19 42.42,11.33 v45.9,14.81
N$2
  Top 0.254: U2.P$3 33.3,21.72 34.59,21.72 R25.1
N$3  (via drill 0.5)
  Top 0.203: IC2.20 v52.27,29.28 v52.27,29.29
  Top 0.254: v86.51,26.16 86.51,19.2 98.78,6.93 98.78,1.32 98.17,0.71 80.57,0.71 U$1.REFRESH
  Bottom 0.203: v52.27,29.29 52.68,29.29 53.34,28.63 84.05,28.63 v86.51,26.16
N$4
  Top 0.203: IC2.12 54.15,25.5 TP8.P$1
N$5  (via drill 0.5)
  Top 0.203: R1.1 49.66,54.14 S3.2 50.98,52.7 53.72,49.96 53.72,47.22 IC1.7 52,45.52 51.08,44.6 51.08,40.18 v49.66,38.76 | IC2.17 52.31,27.2 52.96,27.2 54.25,28.5 54.61,28.5 54.89,28.78 54.89,30.25 v54.51,30.63
  Bottom 0.203: v49.66,38.76 49.53,38.63 49.53,32.54 51.44,30.63 v54.51,30.63
N$6
  Top 0.203: IC1.5 56.24,48.32 Y1.2 61.11,51.47 C2.2
N$7
  Top 0.203: IC1.6 54.36,47.15 Y1.1 57.27,54.81 C3.2
N$8
  Top 0.203: IC1.3 54.11,44.78 58.17,44.78 59.42,43.53 Y2.2 66.21,43.53 C4.2
N$9
  Top 0.203: IC1.4 53.95,45.32 Y2.1 61.84,48.05 C5.2
N$10
  Top 0.203: IC1.1 57.13,43.4 61.92,38.61 71.69,38.61 BAT1.1
N$11  (via drill 0.5)
  Top 0.203: IC1.37 50.26,36.23 v52.53,33.96
  Bottom 0.254: v52.53,33.96 76.43,33.96 85.27,42.8 85.27,47.57 87.17,49.48 JP2.2
N$12  (via drill 0.5)
  Top 0.203: IC1.34 47.93,38.6 v47.93,39.55
  Bottom 0.254: JP2.1 86,52.02 84,50.01 84,45.8 76.56,38.35 60.71,38.35 59.49,39.57 47.95,39.57 v47.93,39.55
N$13
  Top 0.203: IC2.62 43.23,16 43.23,17.07 40.44,19.86 36.45,19.86 R25.2
N$14  (via drill 0.5)
  Top 0.254: U$1.BUSREQ 76.2,10.16 60.4,10.16 v58.01,12.55 | v41.63,21.89 IC2.43
  Bottom 0.254: v41.63,21.89 49.3,14.22 56.34,14.22 v58.01,12.55
N$15
  Top 0.254: IC2.100 62.33,13.21 90.17,13.21 97.03,6.35 U$1.M1
N$16
  Top 0.254: IC2.99 62.13,12.7 88.65,12.7 94.49,6.86 U$1.RD
N$17
  Top 0.254: IC2.98 61.94,12.19 86.11,12.19 91.95,6.35 U$1.WR
N$18
  Top 0.254: IC2.97 61.74,11.68 83.82,11.68 89.41,6.1 U$1.MREQ
N$19
  Top 0.254: IC2.96 61.54,11.18 81.53,11.18 86.87,5.84 U$1.IORQ
N$20
  Top 0.254: IC2.95 61.34,10.67 78.99,10.67 84.33,5.34 U$1.BUSACK
N$21  (via drill 0.5)
  Top 0.203: v38.48,24.54 38.48,24.33 IC2.44
  Top 0.254: U$1.RESET 79.25,5.34 74.93,9.65 59.52,9.65 57.96,11.21 v57.96,11.23
  Bottom 0.254: v57.96,11.23 55.6,13.59 48.46,13.59 38.48,23.57 v38.48,24.54
N$22
  Top 0.254: R10.2 LED3.A
N$23
  Top 0.254: IC2.89 59.13,8.64 70.87,8.64 74.17,5.34 U$1.INTO
N$24  (via drill 0.5)
  Top 0.254: 57.3,20.88 IC2.1 61.5,20.8 v66.55,15.75
  Bottom 0.254: U$1.D0 71.63,10.64 66.55,15.72 v66.55,15.75
N$25
  Top 0.254: IC2.87 58.73,7.62 67.06,7.62 69.09,5.59 U$1.D1
N$26
  Top 0.254: IC2.86 58.53,7.11 64.52,7.11 66.55,5.08 U$1.D2
N$27
  Top 0.254: IC2.85 58.33,6.6 62.48,6.6 64.01,5.08 U$1.D3
N$28
  Top 0.254: IC2.84 58.13,6.1 60.45,6.1 61.47,5.08 U$1.D4
N$29
  Top 0.254: IC2.83 58.93,4.59 U$1.D5
N$30
  Top 0.254: IC2.82 56.39,6.43 U$1.D6
N$31
  Top 0.254: IC2.81 53.85,8.26 U$1.D7
N$32
  Top 0.254: IC2.78 51.31,8.68 U$1.A0
N$33
  Top 0.254: IC2.77 49.78,9.49 49.78,6.6 48.77,5.59 U$1.A1
N$34
  Top 0.254: IC2.76 49.05,9.52 49.05,7.64 46.23,4.82 U$1.A2
N$35
  Top 0.254: IC2.75 43.69,7.26 U$1.A3
N$36
  Top 0.254: IC2.74 41.15,5.43 U$1.A4
N$37
  Top 0.254: IC2.73 41.36,6.35 39.37,6.35 38.61,5.59 U$1.A5
N$38
  Top 0.254: IC2.72 41.16,6.86 37.08,6.86 36.07,5.84 U$1.A6
N$39
  Top 0.254: IC2.71 40.96,7.37 34.8,7.37 33.53,6.09 U$1.A7
N$40
  Top 0.254: IC2.64 36.52,7.87 30.23,7.87 28.45,6.09 U$1.CLK
  Bottom 0.406: U$1.CLK@2 U$1.CLK
N$41
  Top 0.254: U$1.A8 23.37,6.35 25.4,8.38 36.2,8.38 40.46,12.65 40.46,13.94 IC2.61
N$42
  Top 0.254: IC2.58 33.29,8.89 23.62,8.89 20.83,6.09 U$1.A9
N$43
  Top 0.254: IC2.57 33.09,9.4 21.08,9.4 18.29,6.6 U$1.A10
N$44
  Top 0.254: IC2.56 32.9,9.91 19.81,9.91 15.75,5.84 U$1.A11
N$45
  Top 0.254: IC2.55 32.7,10.41 17.53,10.41 13.21,6.1 U$1.A12
N$46
  Top 0.254: IC2.54 32.5,10.92 14.73,10.92 10.67,6.86 U$1.A13
N$47
  Top 0.254: IC2.53 32.3,11.43 12.19,11.43 8.13,7.36 U$1.A14
N$48
  Top 0.254: IC2.52 32.1,11.94 9.91,11.94 5.59,7.62 U$1.A15
N$49
  Top 0.254: IC1.46 58.73,34.94 58.73,23.01 IC2.2
N$50
  Top 0.254: IC1.45 58.17,34.79 58.17,23.16 56.51,21.51 IC2.3
N$51
  Top 0.254: IC1.43 57.61,33.93 57.61,23.32 IC2.4
N$52
  Top 0.254: IC1.42 57.12,33.71 57.12,23.52 IC2.5
N$53
  Top 0.254: IC1.41 56.64,33.48 56.64,23.75 IC2.6
N$54
  Top 0.254: IC1.40 56.08,33.34 56.08,23.9 IC2.7
N$55
  Top 0.254: IC1.39 55.6,33.11 55.6,24.13 IC2.8
N$56
  Top 0.203: IC1.28 44.96,39.85 43.1,38 43.1,32.44 IC2.26 46.26,30.08 R15.1
N$57
  Top 0.203: IC2.27 42.52,32.31 42.52,38.1 44.6,40.18 IC1.27 44.6,40.21
N$58
  Top 0.203: IC2.28 41.88,32.24 41.88,38.18 44.25,40.54 IC1.26
N$59
  Top 0.203: IC2.29 41.27,32.15 41.27,38.3 IC1.25
N$60
  Top 0.203: IC2.30 40.62,32.1 40.62,43.64 41.91,44.93 43.79,44.93 IC1.22
N$61
  Top 0.203: IC2.33 40.08,30.51 40.08,44.02 41.53,45.47 43.94,45.47 44.95,44.46 IC1.21
N$62
  Top 0.203: IC2.34 39.6,30.29 39.6,44.32 41.27,46 44.12,46 IC1.20
N$63
  Top 0.203: IC2.35 39.12,30.06 39.12,44.91 40.74,46.53 44.3,46.53 IC1.19
N$64
  Top 0.203: IC2.36 38.51,29.96 38.51,45.26 40.28,47.04 44.5,47.04 IC1.18
N$65  (via drill 0.5)
  Top 0.203: IC1.32 45.79,37.87 v45.14,37.87
  Top 0.305: R11.1 10.93,17.11 U$2.5
  Bottom 0.254: v45.14,37.87 27,37.87 U$2.5
N$66  (via drill 0.5)
  Top 0.203: IC1.33 45.05,36.42 v45.03,36.42
  Top 0.254: 7.37,14.74 7.37,21.46 | v12.19,21.46 7.37,21.46 | 7.37,21.46 6.18,21.46 U$2.1
  Top 0.305: R24.1 7.37,14.74
  Bottom 0.254: v45.03,36.42 27.15,36.42 v12.19,21.46
N$67
  Top 0.203: IC1.11 51.16,47.48 51.16,48.28 47.45,51.99 47.45,53.24 46.63,54.05 39.7,54.05 38.73,53.09 S4.4 37.12,54.32 R2.1
  Top 0.254: U$3.RST 26.19,54.33 26.95,55.09 26.95,57.45 27.66,58.17 29.64,58.17 33.49,54.32 R2.1
N$68
  Top 0.254: R3.1 24.46,53.25 24.46,55.4 25.71,56.65 U$3.GPIO0
N$69  (via drill 0.5)
  Top 0.203: v35.18,41.25 35.17,41.26 R5.1 | IC1.36 47.78,35.91 v48.06,35.64
  Top 0.254: R5.1 33.62,41.25 IC3.5 30.57,41.11 TP5.P$1
  Bottom 0.203: v35.18,41.25 43.18,41.25 43.26,41.25 44.22,41.25 46.86,38.61 46.86,36.83 v48.06,35.64
N$70  (via drill 0.5)
  Top 0.203: IC1.35 45.57,35.53 v45.57,35.31
  Top 0.254: IC3.6 36.48,42.52 R4.1 36.47,42.51 v36.47,35.31 36.45,35.28 TP6.P$1
  Bottom 0.254: v36.47,35.31 v45.57,35.31
N$71  (via drill 0.5)
  Top 0.203: IC1.31 48.31,41.1 v49.35,41.1
  Bottom 0.203: v49.35,41.1 50.29,42.04 72.92,42.04
  Bottom 0.254: 72.92,42.04 76.38,45.49 JP3.2
N$72  (via drill 0.5)
  Top 0.203: IC1.30 47.3,40.79 v47.3,41.76
  Bottom 0.254: v47.3,41.76 55.3,49.76 73.3,49.76 JP3.1
N$73
  Top 0.203: IC1.2 54.36,44.32 57.71,44.32 61.72,40.31 JP4.1
  Top 0.254: JP4.1 63.07,40.34 LED1.C
N$74
  Top 0.254: LED1.A 68.03,40.31 R6.2
N$75
  Top 0.203: IC1.12 46.8,50.75 33.81,50.75 31.93,52.63 31.93,54.51 29.56,56.87 U$3.RX
N$76
  Top 0.203: IC1.13 45.55,49.53 22.15,49.53 20.64,51.04 U$3.TX
N$77
  Top 0.254: R18.2 LED4.A
N$78
  Top 0.203: 11.96,53.26 17.45,53.26 21.72,49 45.37,49 IC1.14 | 11.96,53.26 10.62,51.92 10.62,43.74 11.77,42.59 SD1.2 | TP1.P$1 11.96,53.26
  Top 0.254: SD1.2 16.04,42.59 16.64,41.99 R7.1
N$79  (via drill 0.5)
  Top 0.203: IC1.17 44.65,47.6 21.16,47.6 v20.27,46.71 | SD1.3 v17.25,43.69 18.75,42.19 TP2.P$1
  Bottom 0.203: v20.27,46.71 v17.25,43.69
N$80
  Top 0.203: IC1.16 44.87,48.09 17.68,48.09 | 17.68,48.09 SD1.7 | TP4.P$1 17.68,49.38 17.68,48.09
N$81
  Top 0.203: 16.2,52.78 16.82,52.78 21.03,48.56 45.1,48.56 IC1.15 | 16.2,52.78 12.29,52.78 11.18,51.66 11.18,46.58 11.87,45.89 SD1.5 | TP3.P$1 16.2,52.78
  Top 0.254: SD1.5 15.78,45.89 R8.1
N$82
  Top 0.254: LED2.C 76.74,40.64 R9.2
N$83
  Top 0.254: R21.2 LED7.A
N$84
  Top 0.254: R19.2 LED5.A
N$85
  Top 0.203: IC1.38 53.42,34.59 53.42,33.3 52.63,32.51 51,32.51 47.68,29.18 47.68,26.34 49.25,24.77 51.31,24.77 52.27,25.73 IC2.15
N$86  (via drill 0.5)
  Top 0.203: v31.14,39.4 31.14,34.21 R17.1 | IC1.10 50.03,45.64 v49.02,45.64
  Top 0.254: IC2.42 34.59,29.63 R17.1
  Bottom 0.203: v49.02,45.64 37.39,45.64 v31.14,39.4
N$87  (via drill 0.5)
  Top 0.203: IC1.29 44.12,38.32 v44.12,33.02 | v39.09,26.87 39.57,26.39 40.66,26.39 IC2.38 | IC2.38
  Top 0.254: R16.1 39.09,27.28 v39.09,26.87
  Bottom 0.203: v44.12,33.02 39.09,27.99 v39.09,26.87
N$88
  Top 0.254: R20.2 LED6.A
N$89
  Top 0.254: R22.2 LED8.A
N$90
  Top 0.254: IC2.47 36.31,24.38 29.97,24.38 29.24,25.11 LED8.C
N$91
  Top 0.254: IC2.48 36.11,23.88 25.4,23.88 24.16,25.11 LED7.C
N$92
  Top 0.254: IC2.49 35.91,23.37 20.32,23.37 19.05,24.64 LED5.C
N$93
  Top 0.254: IC2.50 35.71,22.86 15.24,22.86 13.97,24.13 LED4.C
N$94
  Top 0.254: LED9.A R23.2
N$95  (via drill 0.5)
  Top 0.254: IC2.66 41.8,11.73 v41.76,11.73 | v21.95,18.14 21.95,19.48 22.61,20.14 24.09,20.14 LED9.C
  Bottom 0.254: v41.76,11.73 28.35,11.73 v21.95,18.14
N$96  (via drill 0.5)
  Top 0.254: IC2.68 41.38,9.9 v41.38,9.63 | v16.97,18.14 16.97,19.41 17.68,20.12 19.03,20.12 LED3.C
  Bottom 0.254: v41.38,9.63 25.48,9.63 v16.97,18.14
N$97  (via drill 0.5)
  Top 0.254: IC2.70 41.58,8.69 v40.59,8.69 | v12.19,18.14 12.19,19.28 13.01,20.09 LED6.C
  Bottom 0.254: v40.59,8.69 21.64,8.69 v12.19,18.14
N$98
  Top 0.203: TP7.P$1 54.66,26.75 53.95,26.04 53.27,26.04 IC2.14
N$99  (via drill 0.5)
  Top 0.254: IC2.69 45.39,13.21 46.05,13.21 v46.76,12.5
  Bottom 0.254: U$1.INTI 72.9,3.3 48.01,3.3 47.5,3.81 47.5,11.68 46.76,12.42 v46.76,12.5
N$100  (via drill 0.5)
  Top 0.254: IC2.41 43.85,21.08 v46.99,21.08
  Bottom 0.254: v46.99,21.08 72.9,21.08 76.71,17.27 U$1.NMI
N$101  (via drill 0.5)
  Top 0.254: IC2.40 43.54,22.1 v49.53,22.1
  Bottom 0.254: v49.53,22.1 73.41,22.1 80.52,14.99 80.52,3.3 U$1.WAIT
N$102
  Top 0.254: LED10.A R26.2
N$103  (via drill 0.5)
  Top 0.203: IC2.16 52.62,26.8 v53.59,26.8
  Top 0.254: LED10.C JP5.1
  Bottom 0.203: v53.59,26.8 60.83,26.8 JP5.1
N$104
  Top 0.254: LED11.A R27.2
N$105  (via drill 0.5)
  Top 0.254: IC2.19 51.64,27.94 v52.58,27.94 | LED11.C JP6.1
  Bottom 0.254: v52.58,27.94 64.26,27.94 JP6.1
N$106
  Top 0.254: IC2.91 56.33,12.85 TP9.P$1
N$107
  Top 0.254: IC2.92 55.41,14.48 TP10.P$1
N$108
  Top 0.254: R28.1 21.87,52.41 21.87,55.17 23.18,56.48 U$3.GPIO2
TCK  (via drill 0.5)
  Top 0.203: IC2.24 48.39,28.23 48.39,26.92 v49.4,25.91
  Top 0.254: R12.1 95.25,16.98 JP1.1
  Bottom 0.254: v49.4,25.91 50.93,24.38 93.98,24.38 JP1.1
TDI  (via drill 0.5)
  Top 0.203: IC2.23 52.24,31.37 v52.58,31.37
  Top 0.254: JP1.9 95.25,39.23 R14.2
  Bottom 0.254: JP1.9 95.25,33.15 94.11,32 53.21,32 v52.58,31.37
TDO  (via drill 0.5)
  Top 0.254: IC2.25 49.94,30.48 v50.16,30.48
  Bottom 0.254: v50.16,30.48 51.18,29.46 51.18,26.16 52.32,25.02 88.9,25.02 90.81,26.92 93.98,26.92 JP1.3
TMS  (via drill 0.5)
  Top 0.203: v53.98,29.46 53.62,29.46 52.81,30.28 51.85,30.28 IC2.22
  Top 0.254: R13.2 93.99,29.45 JP1.5
  Bottom 0.203: v53.98,29.46 93.98,29.46 JP1.5

### Text on the board
tNames: UART1 | SWD | SWK | TX | RX | GND | 3V3 | 3V3 | GND | WAIT | GND | TDI | TMS | 3V3 | TDO | GND | TCK | FAP80 I/O Board V2 / dekuNukem 2016